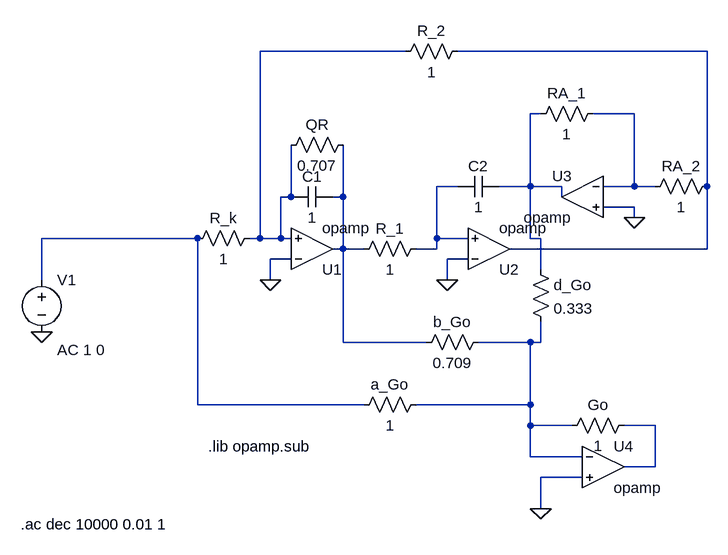
[diagram p0: schematic notch-lp2.asc]
notch-lp2.asc, the LTspice schematic file:
Version 4
SHEET 1 880 680
WIRE 96 -160 -128 -160
WIRE 560 -160 176 -160
WIRE 304 -64 288 -64
WIRE 448 -64 384 -64
WIRE 176 48 144 48
WIRE 288 48 288 -64
WIRE 288 48 240 48
WIRE 336 48 288 48
WIRE 448 48 448 -64
WIRE 448 48 400 48
WIRE 480 48 448 48
WIRE 560 48 560 -160
WIRE -80 64 -80 -16
WIRE -80 64 -96 64
WIRE 0 64 0 -16
WIRE 0 64 -16 64
WIRE 336 64 336 48
WIRE 448 80 400 80
WIRE 448 96 448 80
WIRE -224 128 -464 128
WIRE -128 128 -128 -160
WIRE -128 128 -144 128
WIRE -96 128 -96 64
WIRE -96 128 -128 128
WIRE -80 128 -96 128
WIRE 144 128 144 48
WIRE 192 128 144 128
WIRE 288 128 288 48
WIRE 304 128 288 128
WIRE 0 144 0 64
WIRE 0 144 -16 144
WIRE 32 144 0 144
WIRE 144 144 144 128
WIRE 144 144 112 144
WIRE 560 144 560 48
WIRE 560 144 256 144
WIRE -80 160 -112 160
WIRE 192 160 160 160
WIRE 304 176 304 128
WIRE -464 192 -464 128
WIRE -112 192 -112 160
WIRE 160 192 160 160
WIRE 0 288 0 144
WIRE 128 288 0 288
WIRE 288 288 208 288
WIRE 304 288 304 256
WIRE 304 288 288 288
WIRE -224 384 -224 128
WIRE 32 384 -224 384
WIRE 288 384 288 288
WIRE 288 384 112 384
WIRE 288 416 288 384
WIRE 352 416 288 416
WIRE 480 416 432 416
WIRE 288 464 288 416
WIRE 368 464 288 464
WIRE 480 480 480 416
WIRE 480 480 432 480
WIRE 368 496 304 496
WIRE 304 544 304 496
FLAG -112 192 0
FLAG 160 192 0
FLAG 448 96 0
FLAG 304 544 0
FLAG -464 272 0
SYMBOL Opamps\\opamp -48 208 M180
SYMATTR InstName U1
SYMBOL Opamps\\opamp 224 208 M180
SYMATTR InstName U2
SYMBOL Opamps\\opamp 368 0 M0
SYMATTR InstName U3
SYMBOL Opamps\\opamp 400 416 R0
SYMATTR InstName U4
SYMBOL res -128 112 R90
WINDOW 0 0 56 VBottom 2
WINDOW 3 32 56 VTop 2
SYMATTR InstName R_k
SYMATTR Value 1
SYMBOL res 16 -32 R90
WINDOW 0 0 56 VBottom 2
WINDOW 3 32 56 VTop 2
SYMATTR InstName QR
SYMATTR Value 0.707
SYMBOL res 128 128 R90
WINDOW 0 0 56 VBottom 2
WINDOW 3 32 56 VTop 2
SYMATTR InstName R_1
SYMATTR Value 1
SYMBOL res 192 -176 R90
WINDOW 0 0 56 VBottom 2
WINDOW 3 32 56 VTop 2
SYMATTR InstName R_2
SYMATTR Value 1
SYMBOL res 400 -80 R90
WINDOW 0 0 56 VBottom 2
WINDOW 3 32 56 VTop 2
SYMATTR InstName RA_1
SYMATTR Value 1
SYMBOL res 576 32 R90
WINDOW 0 0 56 VBottom 2
WINDOW 3 32 56 VTop 2
SYMATTR InstName RA_2
SYMATTR Value 1
SYMBOL res 288 160 R0
SYMATTR InstName d_Go
SYMATTR Value 0.333
SYMBOL cap -16 48 R90
WINDOW 0 0 32 VBottom 2
WINDOW 3 32 32 VTop 2
SYMATTR InstName C1
SYMATTR Value 1
SYMBOL cap 240 32 R90
WINDOW 0 0 32 VBottom 2
WINDOW 3 32 32 VTop 2
SYMATTR InstName C2
SYMATTR Value 1
SYMBOL res 224 272 R90
WINDOW 0 0 56 VBottom 2
WINDOW 3 32 56 VTop 2
SYMATTR InstName b_Go
SYMATTR Value 0.709
SYMBOL res 128 368 R90
WINDOW 0 0 56 VBottom 2
WINDOW 3 32 56 VTop 2
SYMATTR InstName a_Go
SYMATTR Value 1
SYMBOL res 448 400 R90
WINDOW 0 0 56 VBottom 2
WINDOW 3 32 56 VTop 2
SYMATTR InstName Go
SYMATTR Value 1
SYMBOL voltage -464 176 R0
WINDOW 123 24 124 Left 2
WINDOW 39 0 0 Left 0
SYMATTR Value2 AC 1 0
SYMATTR InstName V1
SYMATTR Value ""
TEXT -208 448 Left 2 !.lib opamp.sub
TEXT -496 568 Left 2 !.ac dec 10000 0.01 1

The netlist it stands for:
* notch-lp2.asc
XU1 0 N001 N006 opamp Aol=100K GBW=10Meg  ; pins invin noninvin out
XU2 0 N005 N002 opamp Aol=100K GBW=10Meg  ; pins invin noninvin out
XU3 N004 0 N003 opamp Aol=100K GBW=10Meg  ; pins invin noninvin out
XU4 N008 0 N009 opamp Aol=100K GBW=10Meg  ; pins invin noninvin out
R_k N001 N007 1
R§QR N006 N001 0.707
R_1 N005 N006 1
R_2 N002 N001 1
RA_1 N004 N003 1
RA_2 N002 N004 1
R§d_Go N003 N008 0.333
C1 N006 N001 1
C2 N003 N005 1
R§b_Go N008 N006 0.709
R§a_Go N008 N007 1
R§Go N009 N008 1
V1 N007 0 AC 1 0
.lib opamp.sub
.ac dec 10000 0.01 1
.backanno
.end